# Altium schematic sheet MA-Ethernet.SchDoc
size A4; SheetNumber: 2; SheetTotal: 7
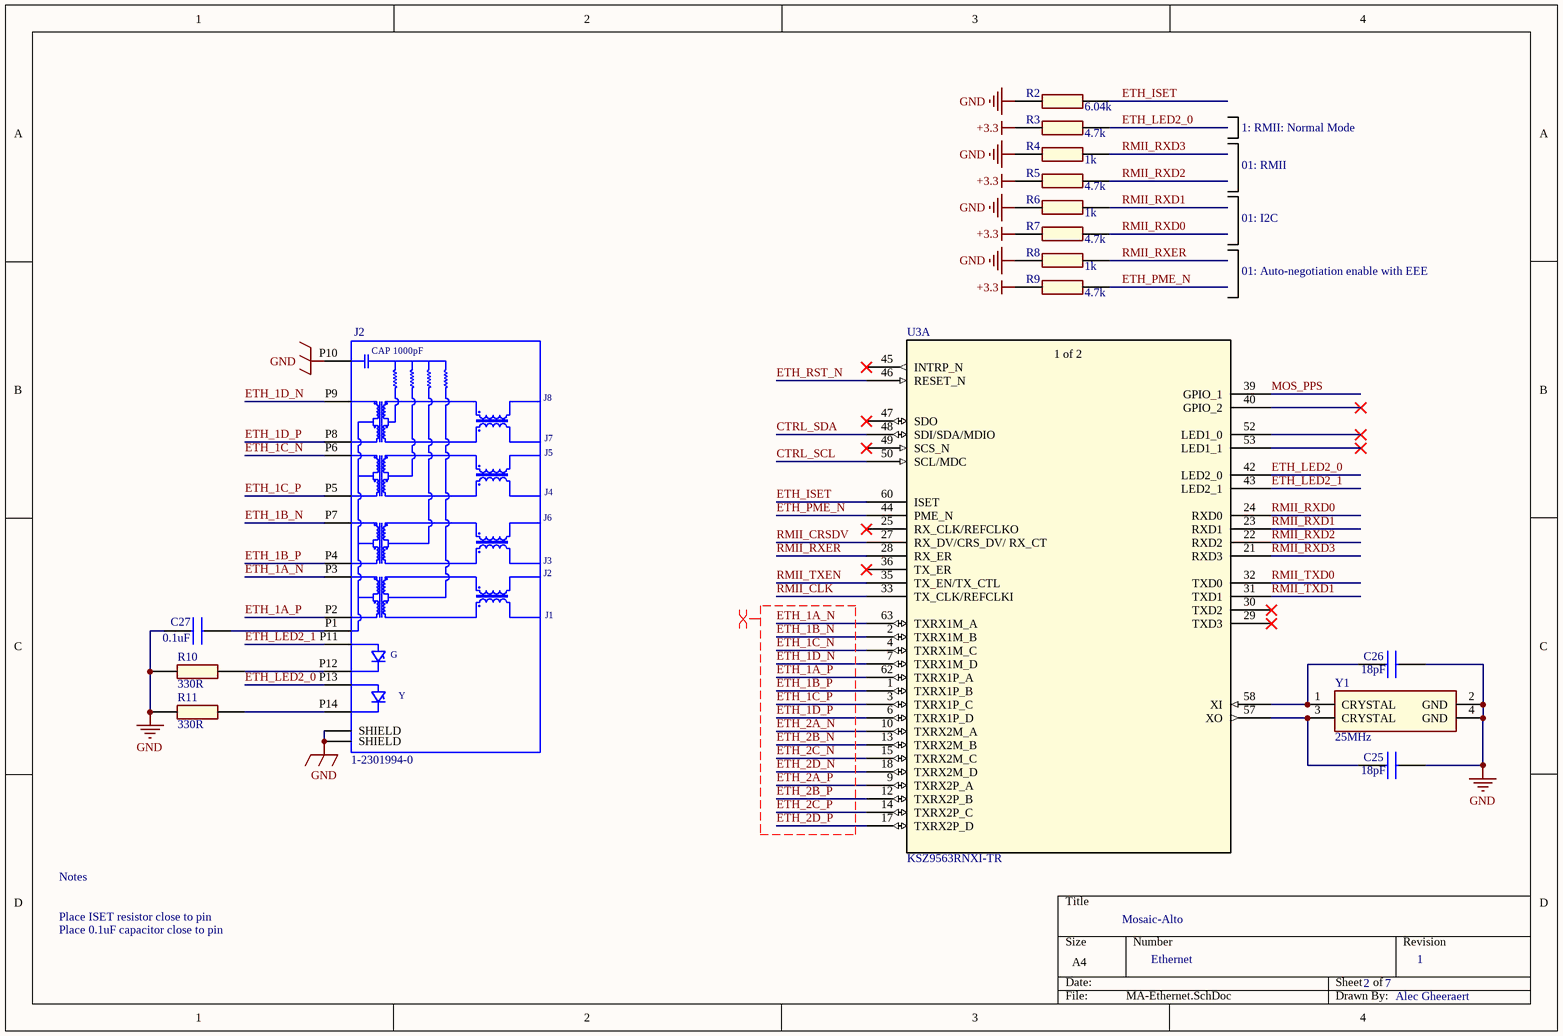
[diagram p0: MA-Ethernet.SchDoc]

## Parts
C25  18pF  [CAPC1608X87N]
C26  18pF  [CAPC1608X87N]
C27  0.1uF  [CAPC2012X145N]
J2  1-2301994-0  [1-2301994-0]
R2  6.04k  [RESC1005X40N]
R3  4.7k  [RESC1005X40N]
R4  1k  [RESC1005X40N]
R5  4.7k  [RESC1005X40N]
R6  1k  [RESC1005X40N]
R7  4.7k  [RESC1005X40N]
R8  1k  [RESC1005X40N]
R9  4.7k  [RESC1005X40N]
R10  330R  [RESC1005X40N]
R11  330R  [RESC1005X40N]
U3  KSZ9563RNXI-TR  [VQFN64_NX_MCH]  (part A of 2)
Y1  25MHz  [LFXTAL055474REEL]

## Nets
+3.3: R3.1 R5.1 R7.1 R9.1
GND: C25.2 C26.2 C27.2 J2.P10 J2.S1(SHIELD) J2.S2(SHIELD) R2.1 R4.1 R6.1 R8.1 R10.2 R11.2 Y1.2(GND) Y1.4(GND)
CTRL_SCL: U3.50(SCL/MDC)
CTRL_SDA: U3.48(SDI/SDA/MDIO)
ETH_1A_N: J2.P3 U3.63(TXRX1M_A)
ETH_1A_P: J2.P2 U3.62(TXRX1P_A)
ETH_1B_N: J2.P7 U3.2(TXRX1M_B)
ETH_1B_P: J2.P4 U3.1(TXRX1P_B)
ETH_1C_N: J2.P6 U3.4(TXRX1M_C)
ETH_1C_P: J2.P5 U3.3(TXRX1P_C)
ETH_1D_N: J2.P9 U3.7(TXRX1M_D)
ETH_1D_P: J2.P8 U3.6(TXRX1P_D)
ETH_2A_N: U3.10(TXRX2M_A)
ETH_2A_P: U3.9(TXRX2P_A)
ETH_2B_N: U3.13(TXRX2M_B)
ETH_2B_P: U3.12(TXRX2P_B)
ETH_2C_N: U3.15(TXRX2M_C)
ETH_2C_P: U3.14(TXRX2P_C)
ETH_2D_N: U3.18(TXRX2M_D)
ETH_2D_P: U3.17(TXRX2P_D)
ETH_ISET: R2.2 U3.60(ISET)
ETH_LED2_0: J2.P13 R3.2 U3.42(LED2_0)
ETH_LED2_1: J2.P11 U3.43(LED2_1)
ETH_PME_N: R9.2 U3.44(PME_N)
ETH_RST_N: U3.46(RESET_N)
MOS_PPS: U3.39(GPIO_1)
RMII_CLK: U3.33(TX_CLK/REFCLKI)
RMII_CRSDV: U3.27(RX_DV/CRS_DV/_RX_CT)
RMII_RXD0: R7.2 U3.24(RXD0)
RMII_RXD1: R6.2 U3.23(RXD1)
RMII_RXD2: R5.2 U3.22(RXD2)
RMII_RXD3: R4.2 U3.21(RXD3)
RMII_RXER: R8.2 U3.28(RX_ER)
RMII_TXD0: U3.32(TXD0)
RMII_TXD1: U3.31(TXD1)
RMII_TXEN: U3.35(TX_EN/TX_CTL)
NetC25_1: C25.1 U3.57(XO) Y1.3(CRYSTAL)
NetC26_1: C26.1 U3.58(XI) Y1.1(CRYSTAL)
NetC27_1: C27.1 J2.P1
NetJ2_P12: J2.P12 R10.1
NetJ2_P14: J2.P14 R11.1

Not connected (* = marked no-connect by the designer): U3 25(RX_CLK/REFCLKO)* 29(TXD3)* 30(TXD2)* 36(TX_ER)* 40(GPIO_2)* 45(INTRP_N)* 47(SDO)* 49(SCS_N)* 52(LED1_0)* 53(LED1_1)*

## Layout directives
differential pair; differential pair class ETH; net class ETH: ETH_1A_N, ETH_1A_P, ETH_1B_N, ETH_1B_P, ETH_1C_N, ETH_1C_P, ETH_1D_N, ETH_1D_P, ETH_2A_N, ETH_2A_P, ETH_2B_N, ETH_2B_P, ETH_2C_N, ETH_2C_P, ETH_2D_N, ETH_2D_P

## Notes on the sheet
- 01: RMII
- 1: RMII: Normal Mode
- 01: I2C
- 01: Auto-negotiation enable with EEE
- Place ISET resistor close to pin
- Notes
- Mosaic-Alto
- Place 0.1uF capacitor close to pin
- Ethernet
- 2
- 7
- 1
- Alec Gheeraert
- (in symbol CMP-00040-2) CAP 1000pF; J8; J7; J5; J4; J6; J3; J1; G; Y
- (in symbol CMP-00057-8, part A) 1 of 2

## Library data of the parts
C25 C26 = CMP-00052-2: 0603 18pF; Manufacturer: Walsin; Dielectric: C0G; Tolerance: 5%; Voltage Rating: 16V; Max Operating Temperature: 125; Package: 0603; Min Operating Temperature: -55; Capacitance: 18pF
C27 = CMP-00059-1: 0805I 0.1µF; Manufacturer: Walsin; Voltage Rating: 50V; Capacitance: 100nF; Qualification: AEC-Q200; Dielectric: X7R; Tolerance: 10%; Min Operating Temperature: 125; Max Operating Temperature: -55; Package: 0805
J2 = CMP-00040-2: RJ45 1Gbit MJ; Manufacturer: TE Connectivity; Magnetic Jack: Yes; Mounting Angle: Right; Data Rate: 10/100/1000 Base-T; Gender: Female; Performance Category: 5e; Max Operating Temperature: 85; USOC: RJ45; Shielding: Yes; Mounting Style: Through Hole; Min Operating Temperature: -40
R2 = CMP-00031-4: 0402I 6.04k; Manufacturer: Walsin; Qualification: AEC-Q200; Tolerance: 1%; Voltage Rating: 50V; Power Rating: 62.5mW; Max Operating Temperature: 155; Resistance: 6.04k; Min Operating Temperature: -55; Package: 0402
R3 R5 R7 R9 = CMP-00030-4: 0402I 4.7k; Manufacturer: Walsin; Power Rating: 62.5mW; Qualification: AEC-Q200; Voltage Rating: 50V; Tolerance: 1%; Max Operating Temperature: 155; Package: 0402; Min Operating Temperature: -55; Resistance: 4.7k
R4 R6 R8 = CMP-00032-3: 0402I 1k; Manufacturer: Walsin; Voltage Rating: 50V; Qualification: AEC-Q200; Power Rating: 62.5mW; Tolerance: 1%; Max Operating Temperature: 155; Resistance: 1k; Package: 0402; Min Operating Temperature: -55
R10 R11 = CMP-00028-4: 0402I 330; Manufacturer: Walsin; Resistance: 330; Qualification: AEC-Q200; Voltage Rating: 50V; Tolerance: 1%; Power Rating: 62.5mW; Max Operating Temperature: 155; Package: 0402; Min Operating Temperature: -55
U3 = CMP-00057-8: 3-Port Gigabit Ethernet Switch; Manufacturer: Texas Instruments; Transceivers: 2; Interfaces: I2C, MII, RGMII, RMII, SPI; Data Rate: 10/100/1000; Ethernet Type: 10/1000 Base-T, 100 Base-TX; Package: VQFN-64; Min Operating Temperature: -40; Max Operating Temperature: 85
Y1 = CMP-00049-4: 25MHz +/-50ppm Crystal; Manufacturer: IQD; Drive Level: 100µW; ESR: 50; Tolerance: 50PPM; Load Capacitance: 16pF; Package: 3.2mm x 2.5mm; Frequency: 25MHz; Min Operating Temperature: -40; Max Operating Temperature: 85